# Altium schematic sheet Processor.SchDoc
size B
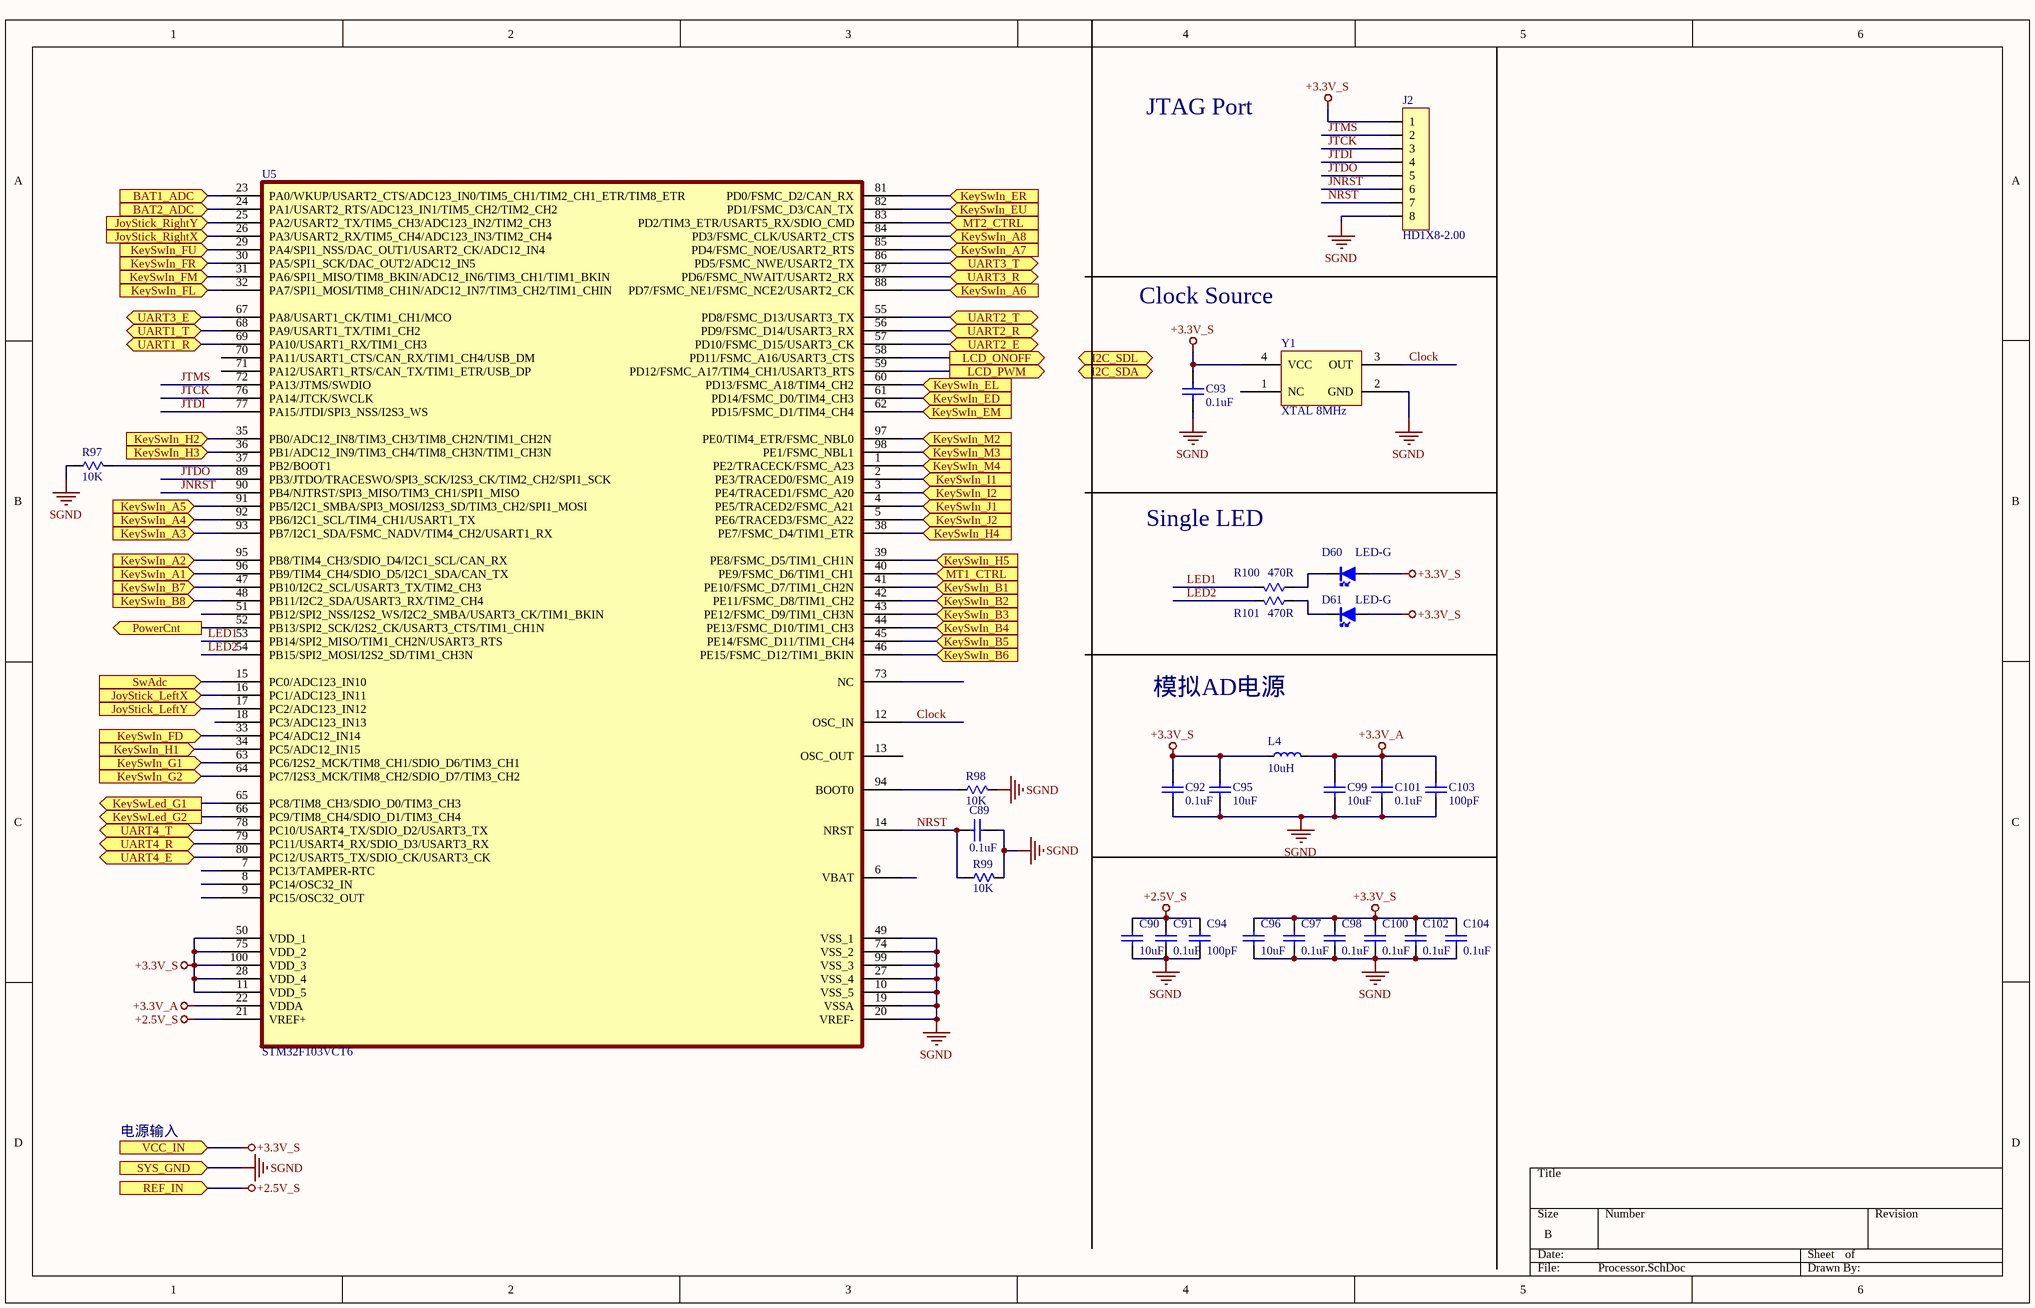
[diagram p0: Processor.SchDoc]

## Parts
C89  0.1uF  [C0603]
C90  10uF  [C0805]
C91  0.1uF  [C0603]
C92  0.1uF  [C0603]
C93  0.1uF  [C0603]
C94  100pF  [C0603]
C95  10uF  [C0805]
C96  10uF  [C0805]
C97  0.1uF  [C0603]
C98  0.1uF  [C0603]
C99  10uF  [C0805]
C100  0.1uF  [C0603]
C101  0.1uF  [C0603]
C102  0.1uF  [C0603]
C103  100pF  [C0603]
C104  0.1uF  [C0603]
D60  LED-G  [LED0805]
D61  LED-G  [LED0805]
J2  HD1X8-2.00  [SHD1X8-2.00]
L4  10uH  [L0603-C]
R97  10K  [R0603]
R98  10K  [R0603]
R99  10K  [R0603]
R100  470R  [R0805]
R101  470R  [R0805]
U5  STM32F103VCT6  [STM32F103VCT6]
Y1  XTAL 8MHz  [XTAL 5.0X7.0-SM]

## Ports
BAT1_ADC (in), BAT2_ADC (in), I2C_SDA (bidir), I2C_SDL (bidir), JoyStick_LeftX (in), JoyStick_LeftY (in), JoyStick_RightX (in), JoyStick_RightY (in), KeySwIn_A1 (in), KeySwIn_A2 (in), KeySwIn_A3 (in), KeySwIn_A4 (in), KeySwIn_A5 (in), KeySwIn_A6 (in), KeySwIn_A7 (in), KeySwIn_A8 (in), KeySwIn_B1 (in), KeySwIn_B2 (in), KeySwIn_B3 (in), KeySwIn_B4 (in), KeySwIn_B5 (in), KeySwIn_B6 (in), KeySwIn_B7 (in), KeySwIn_B8 (in), KeySwIn_ED (in), KeySwIn_EL (in), KeySwIn_EM (in), KeySwIn_ER (in), KeySwIn_EU (in), KeySwIn_FD (in), KeySwIn_FL (in), KeySwIn_FM (in), KeySwIn_FR (in), KeySwIn_FU (in), KeySwIn_G1 (in), KeySwIn_G2 (in), KeySwIn_H1 (in), KeySwIn_H2 (in), KeySwIn_H3 (in), KeySwIn_H4 (in), KeySwIn_H5 (in), KeySwIn_I1 (in), KeySwIn_I2 (in), KeySwIn_J1 (in), KeySwIn_J2 (in), KeySwIn_M2 (in), KeySwIn_M3 (in), KeySwIn_M4 (in), KeySwLed_G1 (out), KeySwLed_G2 (out), LCD_ONOFF (out), LCD_PWM (out), MT1_CTRL (in), MT2_CTRL (in), PowerCnt (out), REF_IN, SwAdc (in), SYS_GND, UART1_R (bidir), UART1_T (bidir), UART2_E (bidir), UART2_R (bidir), UART2_T (bidir), UART3_E (bidir), UART3_R (bidir), UART3_T (bidir), UART4_E (bidir), UART4_R (bidir), UART4_T (bidir), VCC_IN

## Nets
+2.5V_S: C90.1 C91.1 C94.1 U5.21(VREF+) ; port REF_IN
+3.3V_A: C99.2 C101.2 C103.2 L4.2 U5.22(VDDA)
+3.3V_S: C92.2 C93.2 C95.2 C96.1 C97.1 C98.1 C100.1 C102.1 C104.1 D60.1(A) D61.1(A) J2.1 L4.1 U5.11(VDD_5) U5.28(VDD_4) U5.50(VDD_1) U5.75(VDD_2) U5.100(VDD_3) Y1.4(VCC) ; port VCC_IN
SGND: C89.2 C90.2 C91.2 C92.1 C93.1 C94.2 C95.1 C96.2 C97.2 C98.2 C99.1 C100.2 C101.1 C102.2 C103.1 C104.2 J2.8 R97.2 R98.1 R99.1 U5.10(VSS_5) U5.19(VSSA) U5.20(VREF-) U5.27(VSS_4) U5.49(VSS_1) U5.74(VSS_2) U5.99(VSS_3) Y1.2(GND) ; port SYS_GND
BAT1_ADC: U5.23(PA0/WKUP/USART2_CTS/ADC123_IN0/TIM5_CH1/TIM2_CH1_ETR/TIM8_ETR) ; port BAT1_ADC
BAT2_ADC: U5.24(PA1/USART2_RTS/ADC123_IN1/TIM5_CH2/TIM2_CH2) ; port BAT2_ADC
Clock: U5.12(OSC_IN) Y1.3(OUT)
JNRST: J2.6 U5.90(PB4/NJTRST/SPI3_MISO/TIM3_CH1/SPI1_MISO)
JoyStick_LeftX: U5.16(PC1/ADC123_IN11) ; port JoyStick_LeftX
JoyStick_LeftY: U5.17(PC2/ADC123_IN12) ; port JoyStick_LeftY
JoyStick_RightX: U5.26(PA3/USART2_RX/TIM5_CH4/ADC123_IN3/TIM2_CH4) ; port JoyStick_RightX
JoyStick_RightY: U5.25(PA2/USART2_TX/TIM5_CH3/ADC123_IN2/TIM2_CH3) ; port JoyStick_RightY
JTCK: J2.3 U5.76(PA14/JTCK/SWCLK)
JTDI: J2.4 U5.77(PA15/JTDI/SPI3_NSS/I2S3_WS)
JTDO: J2.5 U5.89(PB3/JTDO/TRACESWO/SPI3_SCK/I2S3_CK/TIM2_CH2/SPI1_SCK)
JTMS: J2.2 U5.72(PA13/JTMS/SWDIO)
KeySwIn_A1: U5.96(PB9/TIM4_CH4/SDIO_D5/I2C1_SDA/CAN_TX) ; port KeySwIn_A1
KeySwIn_A2: U5.95(PB8/TIM4_CH3/SDIO_D4/I2C1_SCL/CAN_RX) ; port KeySwIn_A2
KeySwIn_A3: U5.93(PB7/I2C1_SDA/FSMC_NADV/TIM4_CH2/USART1_RX) ; port KeySwIn_A3
KeySwIn_A4: U5.92(PB6/I2C1_SCL/TIM4_CH1/USART1_TX) ; port KeySwIn_A4
KeySwIn_A5: U5.91(PB5/I2C1_SMBA/SPI3_MOSI/I2S3_SD/TIM3_CH2/SPI1_MOSI) ; port KeySwIn_A5
KeySwIn_A6: U5.88(PD7/FSMC_NE1/FSMC_NCE2/USART2_CK) ; port KeySwIn_A6
KeySwIn_A7: U5.85(PD4/FSMC_NOE/USART2_RTS) ; port KeySwIn_A7
KeySwIn_A8: U5.84(PD3/FSMC_CLK/USART2_CTS) ; port KeySwIn_A8
KeySwIn_B1: U5.41(PE10/FSMC_D7/TIM1_CH2N) ; port KeySwIn_B1
KeySwIn_B2: U5.42(PE11/FSMC_D8/TIM1_CH2) ; port KeySwIn_B2
KeySwIn_B3: U5.43(PE12/FSMC_D9/TIM1_CH3N) ; port KeySwIn_B3
KeySwIn_B4: U5.44(PE13/FSMC_D10/TIM1_CH3) ; port KeySwIn_B4
KeySwIn_B5: U5.45(PE14/FSMC_D11/TIM1_CH4) ; port KeySwIn_B5
KeySwIn_B6: U5.46(PE15/FSMC_D12/TIM1_BKIN) ; port KeySwIn_B6
KeySwIn_B7: U5.47(PB10/I2C2_SCL/USART3_TX/TIM2_CH3) ; port KeySwIn_B7
KeySwIn_B8: U5.48(PB11/I2C2_SDA/USART3_RX/TIM2_CH4) ; port KeySwIn_B8
KeySwIn_ED: U5.61(PD14/FSMC_D0/TIM4_CH3) ; port KeySwIn_ED
KeySwIn_EL: U5.60(PD13/FSMC_A18/TIM4_CH2) ; port KeySwIn_EL
KeySwIn_EM: U5.62(PD15/FSMC_D1/TIM4_CH4) ; port KeySwIn_EM
KeySwIn_ER: U5.81(PD0/FSMC_D2/CAN_RX) ; port KeySwIn_ER
KeySwIn_EU: U5.82(PD1/FSMC_D3/CAN_TX) ; port KeySwIn_EU
KeySwIn_FD: U5.33(PC4/ADC12_IN14) ; port KeySwIn_FD
KeySwIn_FL: U5.32(PA7/SPI1_MOSI/TIM8_CH1N/ADC12_IN7/TIM3_CH2/TIM1_CHIN) ; port KeySwIn_FL
KeySwIn_FM: U5.31(PA6/SPI1_MISO/TIM8_BKIN/ADC12_IN6/TIM3_CH1/TIM1_BKIN) ; port KeySwIn_FM
KeySwIn_FR: U5.30(PA5/SPI1_SCK/DAC_OUT2/ADC12_IN5) ; port KeySwIn_FR
KeySwIn_FU: U5.29(PA4/SPI1_NSS/DAC_OUT1/USART2_CK/ADC12_IN4) ; port KeySwIn_FU
KeySwIn_G1: U5.63(PC6/I2S2_MCK/TIM8_CH1/SDIO_D6/TIM3_CH1) ; port KeySwIn_G1
KeySwIn_G2: U5.64(PC7/I2S3_MCK/TIM8_CH2/SDIO_D7/TIM3_CH2) ; port KeySwIn_G2
KeySwIn_H1: U5.34(PC5/ADC12_IN15) ; port KeySwIn_H1
KeySwIn_H2: U5.35(PB0/ADC12_IN8/TIM3_CH3/TIM8_CH2N/TIM1_CH2N) ; port KeySwIn_H2
KeySwIn_H3: U5.36(PB1/ADC12_IN9/TIM3_CH4/TIM8_CH3N/TIM1_CH3N) ; port KeySwIn_H3
KeySwIn_H4: U5.38(PE7/FSMC_D4/TIM1_ETR) ; port KeySwIn_H4
KeySwIn_H5: U5.39(PE8/FSMC_D5/TIM1_CH1N) ; port KeySwIn_H5
KeySwIn_I1: U5.2(PE3/TRACED0/FSMC_A19) ; port KeySwIn_I1
KeySwIn_I2: U5.3(PE4/TRACED1/FSMC_A20) ; port KeySwIn_I2
KeySwIn_J1: U5.4(PE5/TRACED2/FSMC_A21) ; port KeySwIn_J1
KeySwIn_J2: U5.5(PE6/TRACED3/FSMC_A22) ; port KeySwIn_J2
KeySwIn_M2: U5.97(PE0/TIM4_ETR/FSMC_NBL0) ; port KeySwIn_M2
KeySwIn_M3: U5.98(PE1/FSMC_NBL1) ; port KeySwIn_M3
KeySwIn_M4: U5.1(PE2/TRACECK/FSMC_A23) ; port KeySwIn_M4
KeySwLed_G1: U5.65(PC8/TIM8_CH3/SDIO_D0/TIM3_CH3) ; port KeySwLed_G1
KeySwLed_G2: U5.66(PC9/TIM8_CH4/SDIO_D1/TIM3_CH4) ; port KeySwLed_G2
LCD_ONOFF: U5.58(PD11/FSMC_A16/USART3_CTS) ; port LCD_ONOFF
LCD_PWM: U5.59(PD12/FSMC_A17/TIM4_CH1/USART3_RTS) ; port LCD_PWM
LED1: R100.1 U5.53(PB14/SPI2_MISO/TIM1_CH2N/USART3_RTS)
LED2: R101.1 U5.54(PB15/SPI2_MOSI/I2S2_SD/TIM1_CH3N)
MT1_CTRL: U5.40(PE9/FSMC_D6/TIM1_CH1) ; port MT1_CTRL
MT2_CTRL: U5.83(PD2/TIM3_ETR/USART5_RX/SDIO_CMD) ; port MT2_CTRL
NRST: C89.1 J2.7 R99.2 U5.14(NRST)
PowerCnt: U5.52(PB13/SPI2_SCK/I2S2_CK/USART3_CTS/TIM1_CH1N) ; port PowerCnt
SwAdc: U5.15(PC0/ADC123_IN10) ; port SwAdc
UART1_R: U5.69(PA10/USART1_RX/TIM1_CH3) ; port UART1_R
UART1_T: U5.68(PA9/USART1_TX/TIM1_CH2) ; port UART1_T
UART2_E: U5.57(PD10/FSMC_D15/USART3_CK) ; port UART2_E
UART2_R: U5.56(PD9/FSMC_D14/USART3_RX) ; port UART2_R
UART2_T: U5.55(PD8/FSMC_D13/USART3_TX) ; port UART2_T
UART3_E: U5.67(PA8/USART1_CK/TIM1_CH1/MCO) ; port UART3_E
UART3_R: U5.87(PD6/FSMC_NWAIT/USART2_RX) ; port UART3_R
UART3_T: U5.86(PD5/FSMC_NWE/USART2_TX) ; port UART3_T
UART4_E: U5.80(PC12/USART5_TX/SDIO_CK/USART3_CK) ; port UART4_E
UART4_R: U5.79(PC11/USART4_RX/SDIO_D3/USART3_RX) ; port UART4_R
UART4_T: U5.78(PC10/USART4_TX/SDIO_D2/USART3_TX) ; port UART4_T
NetD60_2: D60.2(K) R100.2
NetD61_2: D61.2(K) R101.2
NetR97_1: R97.1 U5.37(PB2/BOOT1)
NetR98_2: R98.2 U5.94(BOOT0)

Not connected (* = marked no-connect by the designer): U5 6(VBAT) 7(PC13/TAMPER-RTC) 8(PC14/OSC32_IN) 9(PC15/OSC32_OUT) 13(OSC_OUT) 18(PC3/ADC123_IN13) 51(PB12/SPI2_NSS/I2S2_WS/I2C2_SMBA/USART3_CK/TIM1_BKIN) 70(PA11/USART1_CTS/CAN_RX/TIM1_CH4/USB_DM) 71(PA12/USART1_RTS/CAN_TX/TIM1_ETR/USB_DP) 73(NC); Y1 1(NC)

## Notes on the sheet
- JTAG Port
- Clock Source
- Single LED
- 模拟AD电源
- 电源输入

## Library data of the parts
C89-C92 C94-C104 = CAP: Published: 8-Jun-2000; LatestRevisionDate: 17-Jul-2002; LatestRevisionNote: Re-released for DXP Platform.; PackageReference: RAD-0.3; Publisher: Altium Limited
  C89 C91 C92 C97 C98 C100-C102 C104: Value: 0.1uF
  C90 C95 C96 C99: Value: 10uF
  C94 C103: Value: 100pF
C93 = Cap: Capacitor; Published: 8-Jun-2000; LatestRevisionDate: 17-Jul-2002; LatestRevisionNote: Re-released for DXP Platform.; PackageReference: RAD-0.3; Publisher: Altium Limited; Value: 0.1uF
D60 D61 = LED
J2 = HEADER1X8
L4 = INDUCTOR: Code_IEC: 1005; Published: 8-Jun-2000; LatestRevisionDate: 17-Jul-2002; LatestRevisionNote: Re-released for DXP Platform.; PackageReference: 0402-A; Publisher: Altium Limited; Code_JEITA: 0402; Value: 10uH
R97-R101 = Res: Resistor; Published: 8-Jun-2000; LatestRevisionDate: 04-Mar-2005; LatestRevisionNote: PCB Footprint replaced.; PackageReference: J1-0603; Publisher: Altium Limited
  R97-R99: Value: 10K
  R100 R101: Value: 470R
Y1 = XTAL